# Altium schematic sheet Proyecto final.SchDoc
size A4; SheetNumber: 1; SheetTotal: 2; SPICEModelCacheGPUJLFXB: <root> / <DocumentId>GPUJLFXB</DocumentId> / </root>
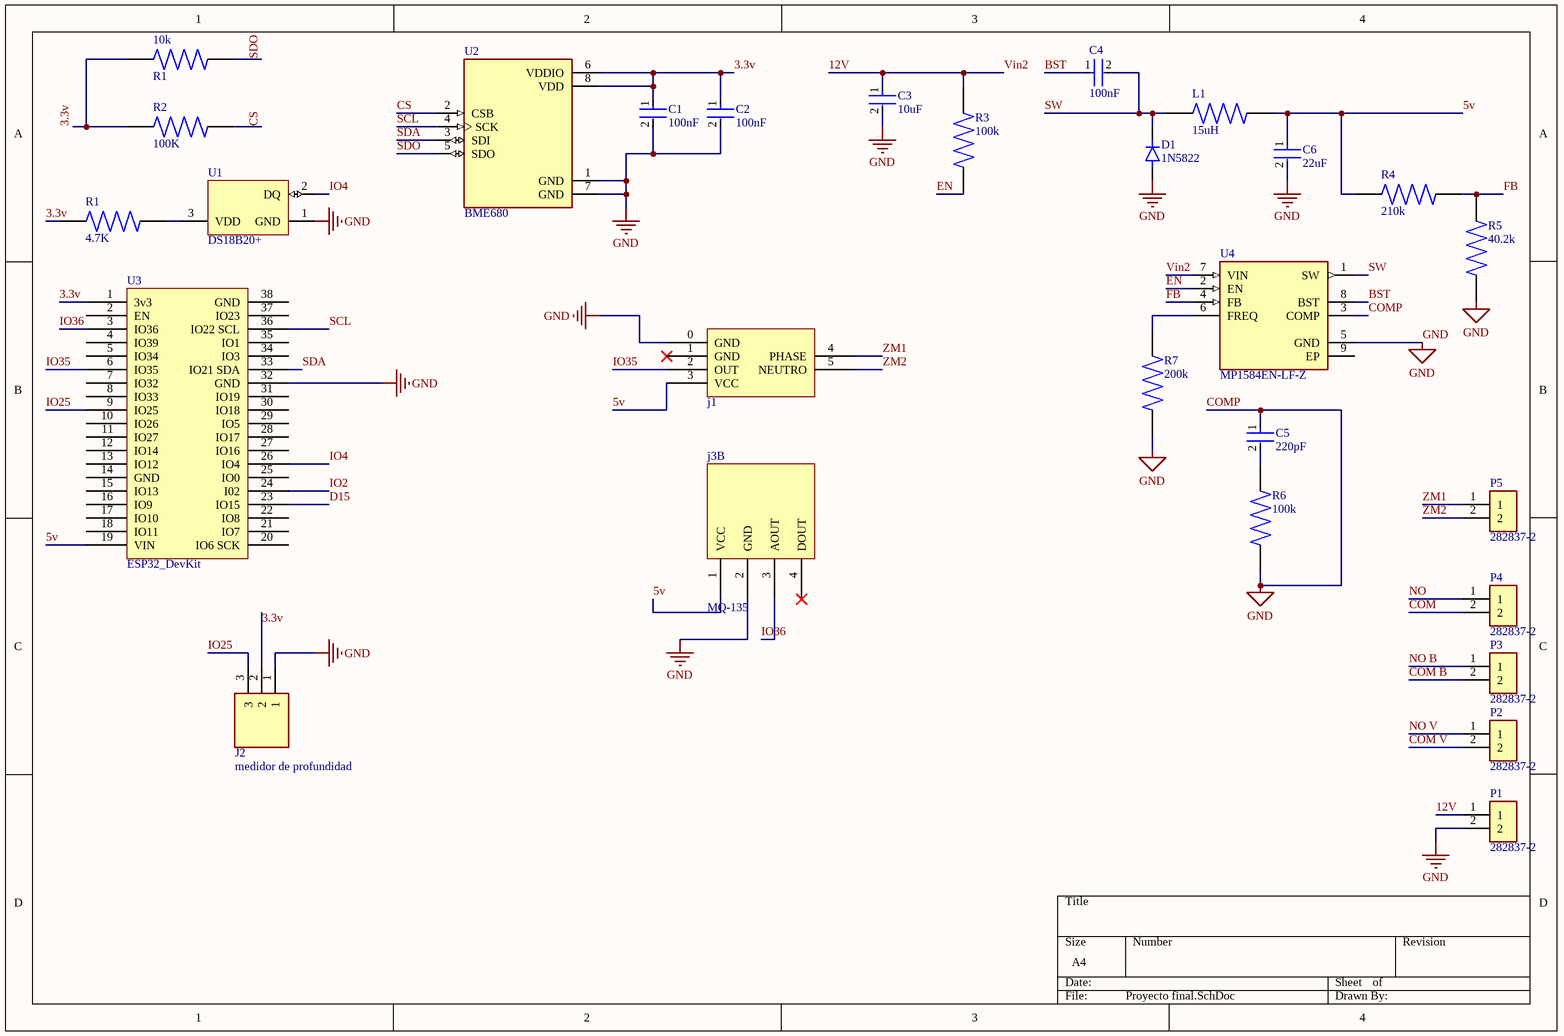
[diagram p0: Proyecto final.SchDoc]

## Parts
10k  R1  [RESC2012X60N]
C1  100nF  [FP-0805-L_2_01_0_2-W_1_25-MFG]
C2  100nF  [FP-0805-L_2_01_0_2-W_1_25-MFG]
C3  10uF  [FP-0805-L_2_01_0_2-W_1_25-MFG]
C4  100nF  [FP-0805-L_2_01_0_2-W_1_25-MFG]
C5  220pF  [FP-0805-L_2_01_0_2-W_1_25-MFG]
C6  22uF  [FP-0805-L_2_01_0_2-W_1_25-MFG]
D1  1N5822  [DIOAD1990W125L900D530]
j1  ZMPT101B  [ZMBPT101]  (value not drawn)
J2  medidor de profundidad  [Block terminal 3]
j3  MQ-135  [PCBComponent_1]  (part B of 2)
L1  15uH  [RESAD700W45L350D185]
P1  282837-2  [TE_282837-2]
P2  282837-2  [TE_282837-2]
P3  282837-2  [TE_282837-2]
P4  282837-2  [TE_282837-2]
P5  282837-2  [TE_282837-2]
R1  4.7K  [RESC2012X60N]
R2  100K  [RESC2012X60N]
R3  100k  [RESC2012X60N]
R4  210k  [RESC2012X60N]
R5  40.2k  [RESC2012X60N]
R6  100k  [RESC2012X60N]
R7  200k  [RESC2012X60N]
U1  DS18B20+  [Q3+1]
U2  BME680  [PSON80P300X300X100-8N]
U3  ESP32_DevKit  [ESP DEVKIT]
U4  MP1584EN-LF-Z  [SOIC127P600X170-9N]

## Nets
COMP: C1.2 C2.2 C3.2 C5.1 C6.2 D1.A j1.0(GND) J2.1 j3.2(GND) P1.2 R5.2 R6.1 R7.1 U1.1(GND) U2.1(GND) U2.7(GND) U3.32(GND) U4.3(COMP) U4.5(GND)  [also labelled GND]
3.3v: 10k.1 C1.1 C2.1 J2.2 R1.2 R2.2 U2.6(VDDIO) U2.8(VDD) U3.1(3v3)
5v: C6.1 j1.3(VCC) j3.1(VCC) L1.2 R4.2 U3.19(VIN)
12V: C3.1 P1.1 R3.2 U4.7(VIN)  [also labelled Vin2]
BST: C4.1 U4.8(BST)
COM: P4.2
COM B: P3.2
COM V: P2.2
CS: R2.1 U2.2(CSB)
D15: U3.23(IO15)
EN: R3.1 U4.2(EN)
FB: R4.1 R5.1 U4.4(FB)
IO2: U3.24(I02)
IO4: U1.2(DQ) U3.26(IO4)
IO25: J2.3 U3.9(IO25)
IO35: j1.2(OUT) U3.6(IO35)
IO36: j3.3(AOUT) U3.3(IO36)
NO: P4.1
NO B: P3.1
NO V: P2.1
SCL: U2.4(SCK) U3.36(IO22_SCL)
SDA: U2.3(SDI) U3.33(IO21_SDA)
SDO: 10k.2 U2.5(SDO)
SW: C4.2 D1.C(K) L1.1 U4.1(SW)
ZM1: j1.4(PHASE) P5.1
ZM2: j1.5(NEUTRO) P5.2
NetC5_2: C5.2 R6.2
NetR1_1: R1.1 U1.3(VDD)
NetR7_2: R7.2 U4.6(FREQ)

Not connected (* = marked no-connect by the designer): j1 1(GND)*; j3 4(DOUT)*; U3 2(EN) 4(IO39) 5(IO34) 7(IO32) 8(IO33) 10(IO26) 11(IO27) 12(IO14) 13(IO12) 14(GND) 15(IO13) 16(IO9) 17(IO10) 18(IO11) 20(IO6_SCK) 21(IO7) 22(IO8) 25(IO0) 27(IO16) 28(IO17) 29(IO5) 30(IO18) 31(IO19) 34(IO3) 35(IO1) 37(IO23) 38(GND); U4 9(EP)

## Library data of the parts
10k R1-R7 = RC0805FR-07910RL: 910 Ohms Â±1% 0.125W, 1/8W Chip Resistor 0805 (2012 Metric) Moisture Resistant Thick Film; MF: Yageo; Package: 2012 Rohm Semiconductor; Value: *; Purchase-URL: https://pricing.snapeda.com/search/part/RC0805FR-07910RL/?ref=eda; Availability: In Stock; MP: RC0805FR-07910RL; Price: None
C1-C6 = CMP-1036-02979-3: General Purpose Ceramic Capacitor, 0805, 1nF, 10%, X7R, 0.15, 50V; Dissipation Factor: 2.5%; Insulation Resistance: 100GR; Radiation Hardening: No; Case Code (Imperial): 0805; Packaging: Tape and Reel; Height: 0.94mm; Number of Pins: 2; REACH SVHC: No SVHC; Case Code (Metric): 2012; Voltage: 50V; Max Operating Temperature: 125°C; Tolerance: 10%; Voltage Rating: 50V; Depth: 1.25mm; Voltage Rating (DC): 50V; Thickness: 0.037inch; Termination: SMD/SMT; Package Quantity: 1; RoHS Compliant: Yes; Mount: Surface Mount; Dielectric: X7R; Length: 2.01mm; Contact Plating: Tin; Lead Free: Lead Free; Case/Package: 0805; Width: 1.25mm; Capacitance: 1nF; Dielectric Material: Ceramic; Min Operating Temperature: -55°C
D1 = 1N5822: 3A, 40V, Planar Schottky; MF: Taiwan Semiconductor; SnapEDA_Link: https://www.snapeda.com/parts/1N5822/taiwan/view-part/?ref=snap; Package: DO-201AD Taiwan Semiconductor; Value: *; MP: 1N5822; Check_prices: https://www.snapeda.com/parts/1N5822/taiwan/view-part/?ref=eda
J2 = TB004-508-03BE: 2~24 Poles, Screw Type, Horizontal, 5.08 Pitch, 24~12 (AWG), Terminal Block Connector; MF: Same Sky; SnapEDA_Link: https://www.snapeda.com/parts/TB004-508-03BE/Same+Sky/view-part/?ref=snap; Package: None; Value: *; MP: TB004-508-03BE; Check_prices: https://www.snapeda.com/parts/TB004-508-03BE/Same+Sky/view-part/?ref=eda
L1 = 3-1623927-1: 1 MOhms Â±5% 0.25W, 1/4W Through Hole Resistor Axial - Carbon Film; MF: TE Connectivity; SnapEDA_Link: https://www.snapeda.com/parts/3-1623927-1/TE+Connectivity/view-part/?ref=snap; Package: None; Value: *; MP: 3-1623927-1; Check_prices: https://www.snapeda.com/parts/3-1623927-1/TE+Connectivity/view-part/?ref=eda
P1-P5 = 282837-2: Ð Ð°Ð·ÑŠÐµÐ¼Ð½Ñ‹Ðµ ÐºÐ»ÐµÐ¼Ð¼Ð½Ñ‹Ðµ ÐºÐ¾Ð»Ð¾Ð´ÐºÐ¸ Ð Ð¾Ð·ÐµÑ‚ÐºÐ° 2 Ð¿Ð¾Ð»Ð¾Ð¶ÐµÐ½Ð¸Ñ 5,08 Ð¼Ð¼ ÐŸÑ€Ð¸Ð¿Ð¾Ð¹ Ð¿Ñ€ÑÐ¼Ð¾Ð¹ Ñ‡ÐµÑ€ÐµÐ· Ð¾Ñ‚Ð²ÐµÑ€ÑÑ‚Ð¸Ðµ 13,5 Ð / ÐºÐ¾Ð½Ñ‚Ð°ÐºÑ‚; MF: TE Connectivity; SnapEDA_Link: https://www.snapeda.com/parts/282837-2/TE+Connectivity+AMP+Connectors/view-part/?ref=snap; Price: None; Check_prices: https://www.snapeda.com/parts/282837-2/TE+Connectivity+AMP+Connectors/view-part/?ref=eda; Purchase-URL: https://pricing.snapeda.com/search/part/282837-2/?ref=eda; MP: 282837-2; Value: *; Availability: In Stock; Package: None
U1 = CMP-0253-00003-1: Programmable Resolution Digital Thermometer, 1-Wire Interface, ±0.5°C Accuracy, 3-Pin TO92, -55°C to +125°C, Pb-Free; ComponentLink2URL: http://datasheets.maxim-ic.com/en/ds/DS18B20.pdf; PackageReference: Q3+1; ComponentLink1Description: Manufacturer URL; PackageDescription: TO-92 Package, Body Dia. 4.7mm; Leads 0.51 x 0.51 mm (max), Pb-Free; DatasheetVersion: 2007; Code_JEDEC: TO-226-AA; ComponentLink1URL: http://www.maxim-ic.com; PackageVersion: revB, 2009; ComponentLink2Description: Datasheet
U2 = BME680: Gas, Humidity, Pressure, Temperature Sensor I2C, SPI Output; MF: Bosch Sensortec; SnapEDA_Link: https://www.snapeda.com/parts/BME680/Bosch+Sensortec/view-part/?ref=snap; Package: LGA-8 Bosch Tools; Value: *; MP: BME680; Check_prices: https://www.snapeda.com/parts/BME680/Bosch+Sensortec/view-part/?ref=eda
U4 = MP1584EN-LF-Z: Buck Switching Regulator IC Positive Adjustable 0.8V 1 Output 3A 8-SOIC (0.154, 3.90mm Width) Exposed Pad; MF: Monolithic Power Systems; MP: MP1584ENLFZ; SnapEDA_Link: https://www.snapeda.com/parts/MP1584ENLFZ/Monolithic+Power+Systems/view-part/?ref=snap; Package: SOIC-8 Monolithic Power Systems; Value: *; Check_prices: https://www.snapeda.com/parts/MP1584ENLFZ/Monolithic+Power+Systems/view-part/?ref=eda